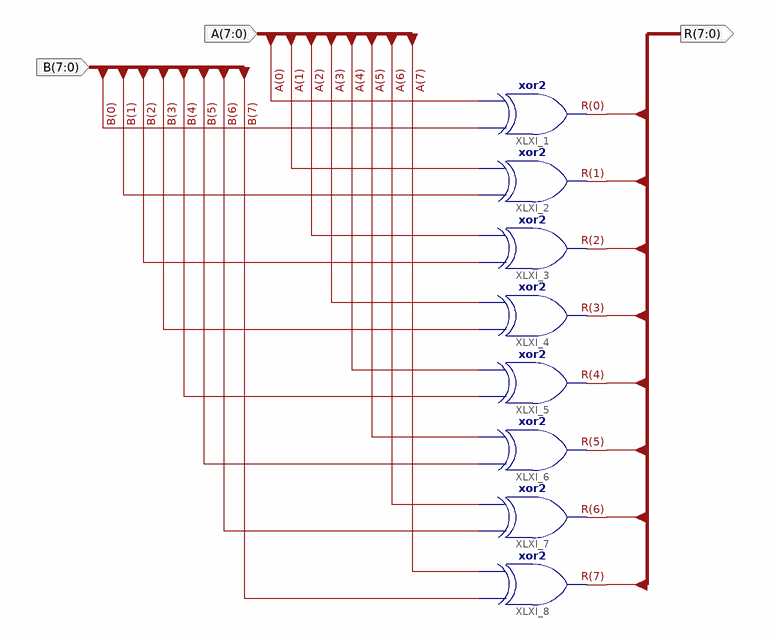
[diagram p0: schematic sheet 1]
// Xilinx ISE schematic xor2x8b.sch (spartan6) as structural Verilog: 8 symbols, 3 ports
module xor2x8b (
  input  [7:0] B,
  input  [7:0] A,
  output [7:0] R
);

  xor XLXI_1 (R[0], B[0], A[0]);
  xor XLXI_2 (R[1], B[1], A[1]);
  xor XLXI_3 (R[2], B[2], A[2]);
  xor XLXI_4 (R[3], B[3], A[3]);
  xor XLXI_5 (R[4], B[4], A[4]);
  xor XLXI_6 (R[5], B[5], A[5]);
  xor XLXI_7 (R[6], B[6], A[6]);
  xor XLXI_8 (R[7], B[7], A[7]);
endmodule
